# EAGLE design plutosdr-revb-extclk (EAGLE 7.7.0)
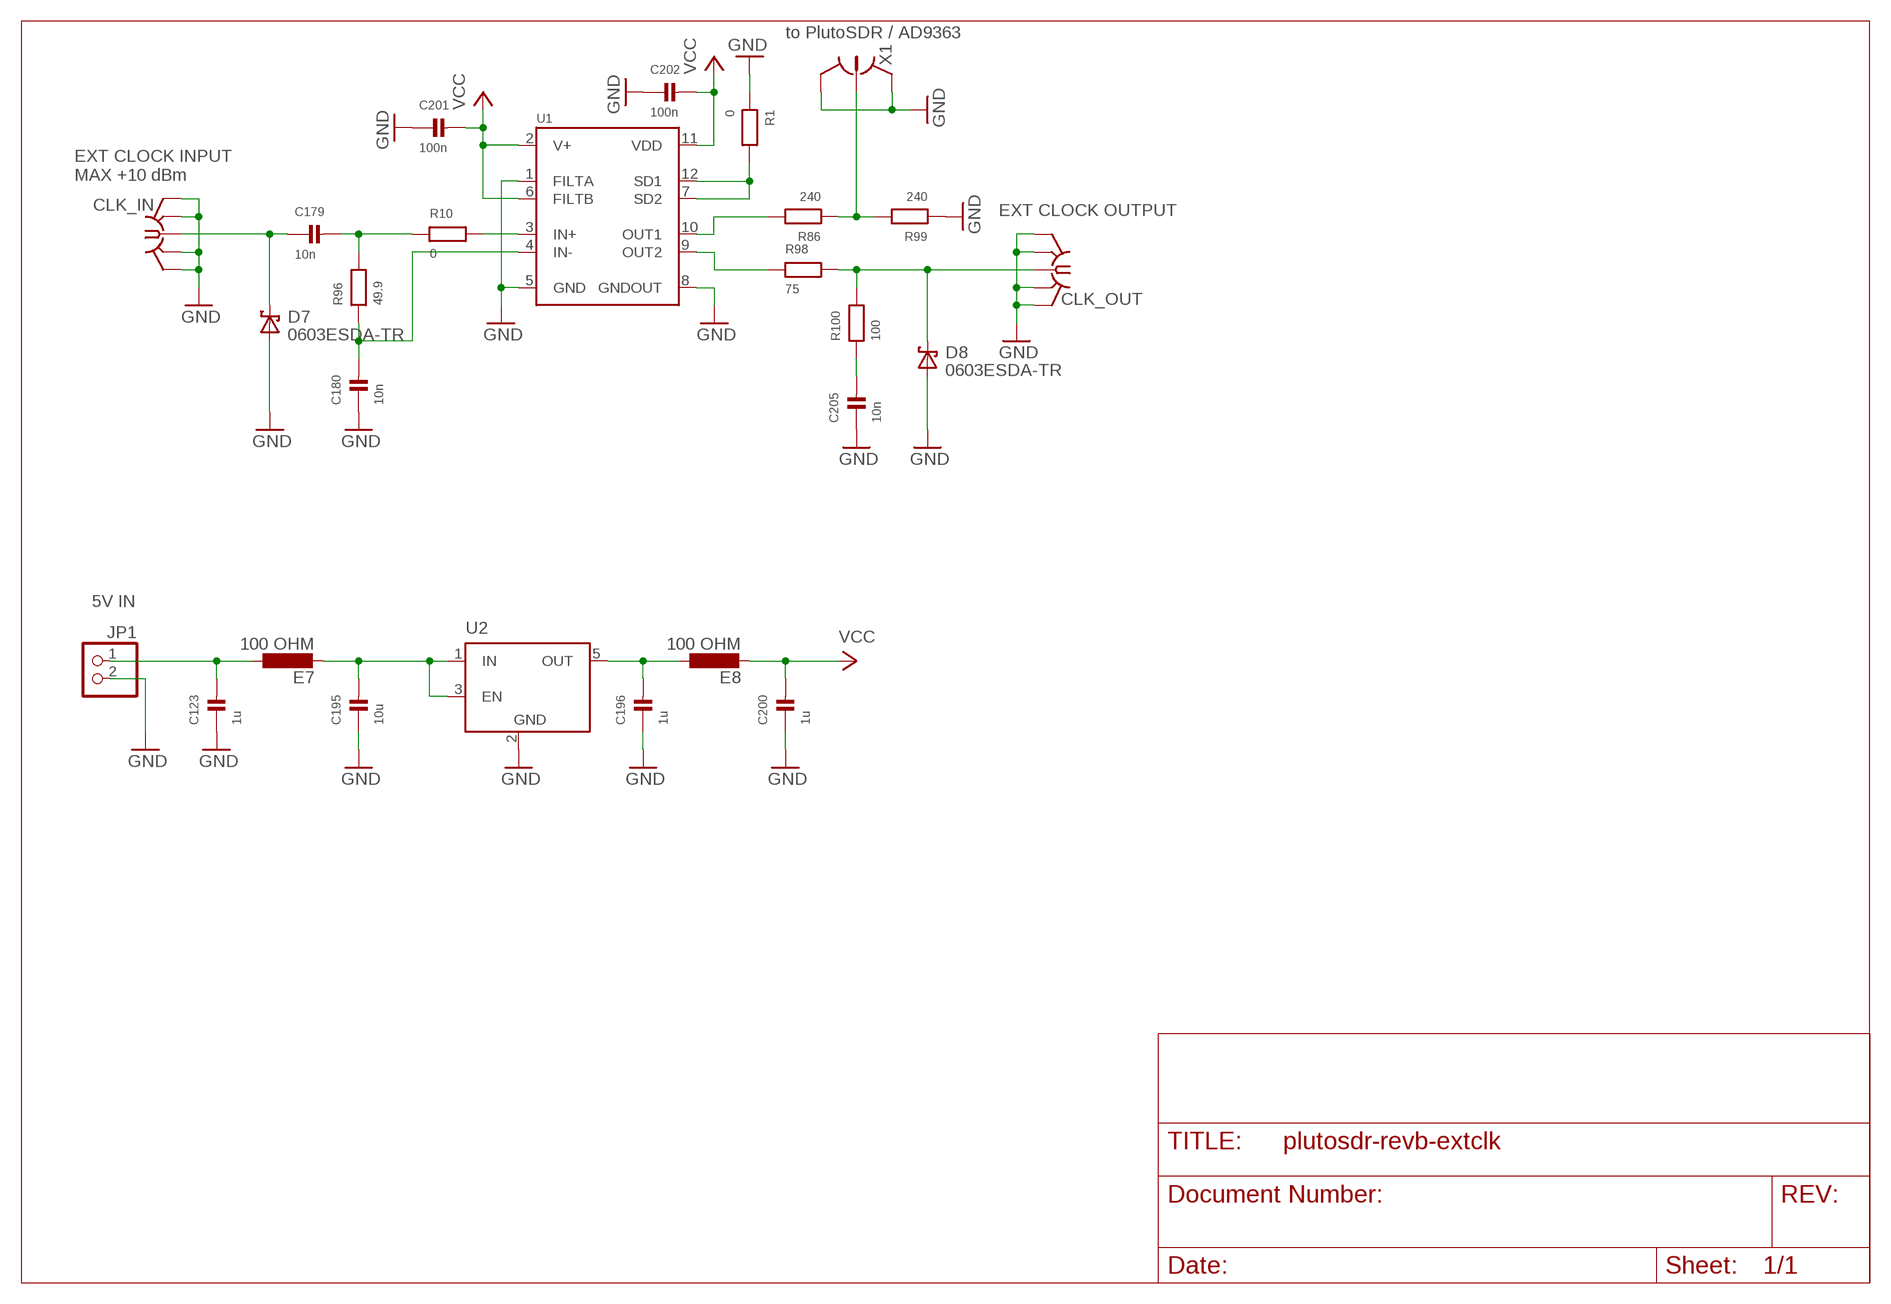
[diagram p0: schematic, sheet 1]

## Parts
C123  1u  CAP_CERAMIC_0603  [_0603]
C179  10n  CAP_CERAMIC_0603  [_0603]
C180  10n  CAP_CERAMIC_0603  [_0603]
C195  10u  CAP_CERAMIC_0805  [_0805]
C196  1u  CAP_CERAMIC_0603  [_0603]
C200  1u  CAP_CERAMIC_0603  [_0603]
C201  100n  CAP_CERAMIC_0603  [_0603]
C202  100n  CAP_CERAMIC_0603  [_0603]
C205  10n  CAP_CERAMIC_0603  [_0603]
CLK_IN  SMA-F73251-2201  [SMA-F-S-TH-73251-2201]
CLK_OUT  SMA-F73251-2201  [SMA-F-S-TH-73251-2201]
D7  0603ESDA-TR  [0603]
D8  0603ESDA-TR  [0603]
E7  100 OHM  INDUCTOR0805  [0805]
E8  100 OHM  INDUCTOR0805  [0805]
JP1  PINHD-1X2/90  [1X02/90]
R1  0  RESISTOR_0603  [_0603]
R10  0  RESISTOR_0603  [_0603]
R86  240  RESISTOR_0603  [_0603]
R96  49.9  RESISTOR_0603  [_0603]
R98  75  RESISTOR_0603  [_0603]
R99  240  RESISTOR_0603  [_0603]
R100  100  RESISTOR_0603  [_0603]
U1  LTC6957-3/4-HMS  [MSOP12]
U2  LDO_FIXED_EN-ADM7160AUJZ  [SOT23L]
X1  HRS_UFL  [HRS_UFL]

## Nets
3V3_OUT: C196.2 E8.1 U2.5(OUT)
5V_FILTERED: C195.2 E7.2 U2.1(IN) U2.3(EN)
5V_IN: C123.2 E7.1 JP1.1
GND: C123.1 C180.1 C195.1 C196.1 C200.1 C201.1 C202.1 C205.1 CLK_IN.G1(GND) CLK_IN.G2(GND) CLK_IN.G3(GND) CLK_IN.G4(GND) CLK_OUT.G1(GND) CLK_OUT.G2(GND) CLK_OUT.G3(GND) CLK_OUT.G4(GND) D7.1(A) D8.1(A) JP1.2 R1.1 R99.1 U1.1(FILTA) U1.5(GND) U1.8(GNDOUT) U2.2(GND) X1.GND@1(GND) X1.GND@2(GND)
N$1: R86.1 R99.2 X1.SIG
N$2: R86.2 U1.10(OUT1)
N$3 [RF]: R10.2 U1.3(IN+)
N$4: C180.2 R96.1 U1.4(IN-)
N$5 [RF]: C179.2 R10.1 R96.2
N$6 [RF]: R98.1 U1.9(OUT2)
N$7: R1.2 U1.7(SD2) U1.12(SD1)
N$8 [RF]: CLK_OUT.C D8.2(K) R98.2 R100.2
N$9: C205.2 R100.1
N$10 [RF]: C179.1 CLK_IN.C D7.2(K)
VCC: C200.2 C201.2 C202.2 E8.2 U1.2(V+) U1.6(FILTB) U1.11(VDD)

## Notes on the sheet
- to PlutoSDR / AD9363
- EXT CLOCK INPUT
  MAX +10 dBm
- EXT CLOCK OUTPUT
- 5V IN

## Library data of the parts
C123 C179 C180 C195 C196 C200-C202 C205 = rc-sysmocom:CAP_CERAMIC: Ceramic Capacitors 0402 - 0402 Surface Mount Capacitors 16pF 50V 5% [Digikey: 445-4899-2-ND] 18pF 50V 5% [Digikey: 490-1281-2-ND] 22pF 50V 5% [Digikey: 490-1283-2-ND] 68pF 50V 5% [Digikey: 490-1289-2-ND] 0.1uF 10V 10% [Digikey: 490-1318-2-ND] 1.0uF 6.3V 10% [Digikey: 490-1320-2-ND] 0603 - 0603 Surface Mount Capacitors 16 pF 50V 5% [Digikey: 445-5051-2-ND] 22 pF 50V [Digikey: PCC220ACVTR-ND] 33 pF 50V 5% [Digikey: 490-1415-1-ND] 56pF 50V 5% [Digikey: 490-1421-1-ND] 220pF 50V 5% [Digikey: 445-1285-1-ND] 680 pF 50V 2200 pF 50V 5% C0G [Digikey: 445-1297-1-ND] 5600 pF 100V 5% X7R [Digikey: 478-3711-1-ND] 0.1 µF 25V 10% [Digikey: PCC2277TR-ND] 0.22 µF 16V 10% X7R [Digikey: 445-1318-1-ND] 1.0 µF 25V 10% [Digikey: 445-5146-2-ND] 0603 - RF Specific 3pF 250V +/-0.1pF RF [Digikey: 712-1347-1-ND] 18 pF 250V 5% [Digikey: 478-3505-1-ND or 712-1322-1-ND] 56 pF 250V 5% C0G RF [Digikey: 490-4867-1-ND] 68 pF 250V RF [Digikey: 490-4868-1-ND] 0805 - 0805 Surface Mount Capacitors 220 pF 250V 2% RF Ceramic Capacitor [Digikey: 712-1398-1-ND] 1000 pF 50V 2% NP0 Ceramic Capacitor [Digikey: 478-3760-1-ND] 0.1 µF 25V 10% Ceramic Capacitor [Digikey: PCC1828TR-ND] 1.0 µF 16V 10% Ceramic Capacitor[Digikey: 490-1691-2-ND] 10.0 µF 10V 10% Ceramic Capacitor[Digikey: 709-1228-1-ND] 10.0 uF 16V 10% Ceramic Capacitor [Digikey: 478-5165-2-ND] 47 uF 6.3V 20% Ceramic Capacitor [Digikey: 587-1779-1-ND or 399-5506-1-ND] 1206 - 1206 Surface Mount Capacitors 47uF 10V 20% Ceramic Capacitor [Digikey: 490-5528-1-ND or 399-5508-1-ND or 445-6010-1-ND] 100uF 6.3V -20%, +80% Y5V Ceramic Capacitor (Digikey: 490-4512-1-ND, Mouser: 81-GRM31CF50J107ZE1L) 1810 - 1810 Surface Mount Capacitors High volt MLC; no solder stop between for higher isolation
CLK_IN CLK_OUT = laforge:SMA-F
D7 D8 = laforge:0603ESDA-TR: Bussmann 0603ESDA-TR ESD Suppressor
E7 E8 = rc-sysmocom:INDUCTOR
JP1 = laforge:PINHD-1X2: PIN HEADER
R1 R10 R86 R96 R98-R100 = rc-sysmocom:RESISTOR: Resistors 0402 - 0402 Surface Mount Package 22 Ohm 1% 1/16W [Digikey: 311-22.0LRTR-ND] 33 Ohm 5% 1/16W 1.0K 5% 1/16W 1.5K 5% 1/16W 2.0K 1% 1/16W 10.0K 1% 1/16W [Digikey: 311-10.0KLRTR-ND] 10.0K 5% 1/16W [Digikey: RMCF0402JT10K0TR-ND] 12.1K 1% 1/16W [Digikey: 311-22.0LRTR-ND] 100.0K 5% 1/16W 0603 - 0603 Surface Mount Package 1/10 Watt 0805 - 0805 Surface Mount Package 1/8 Watt 1206 - 1206 Surface Mount Package 2012 - 2010 Surface Mount Package 0.11 Ohm 1/2 Watt 1% Resistor - Digikey: RHM.11UCT-ND
U1 = cdclvc-clockbuf:LTC6957-3/4: LTC6957-1/LTC6957-2/LTC6957-3/LTC6957-4 Low Phase Noise, Dual Output Buffer/Driver/Logic Converter
U2 = ldo:LDO_FIXED_EN: ADM7160 Untralow Noise 200mA linear regulator
X1 = laforge:HRS_UFL: Hirose U.FL SMT; OC_DIGIKEY: H9161CT-ND

## Net classes
1 RF: width 1.5 mm, clearance 0.254 mm

## Board
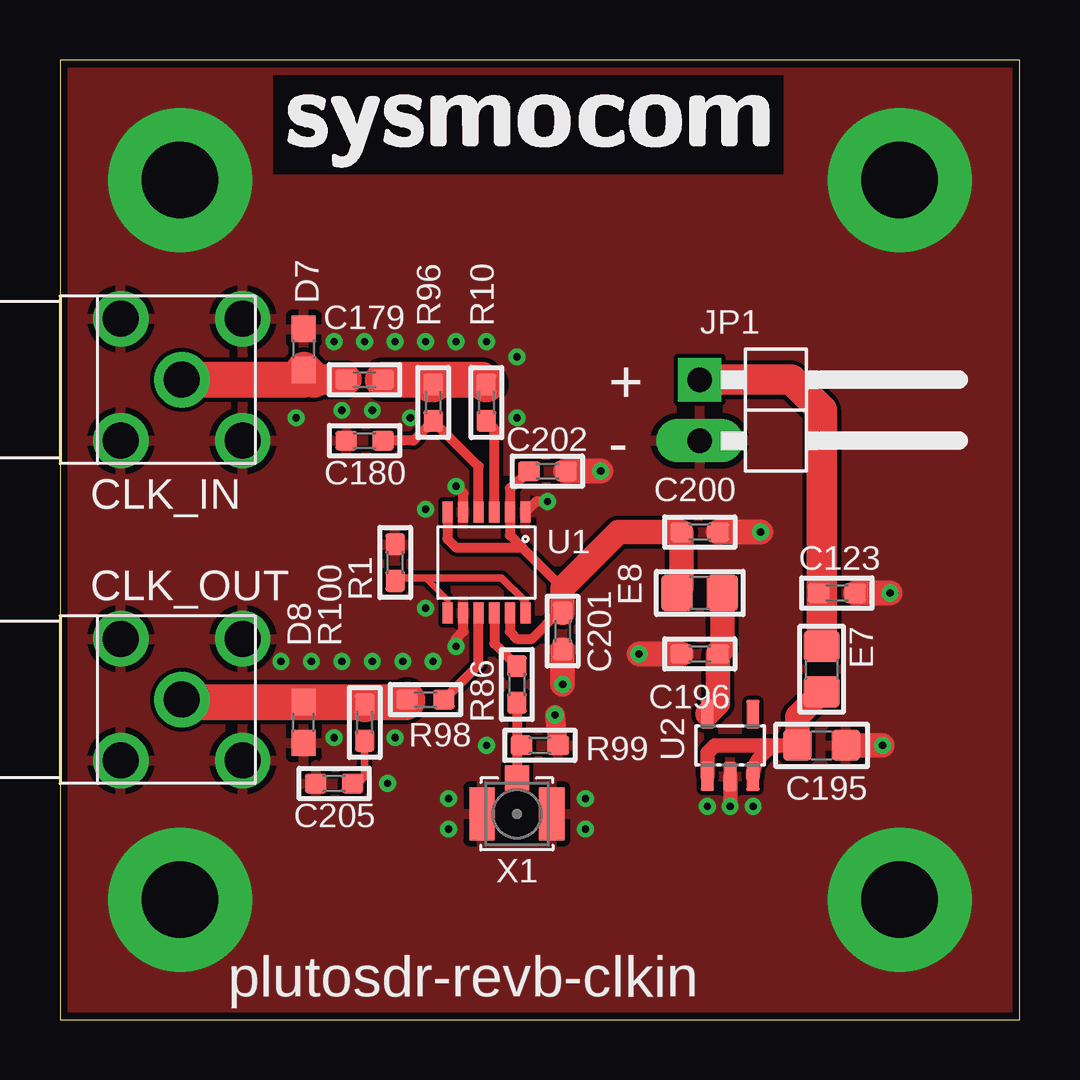
[diagram p1: board, top side]
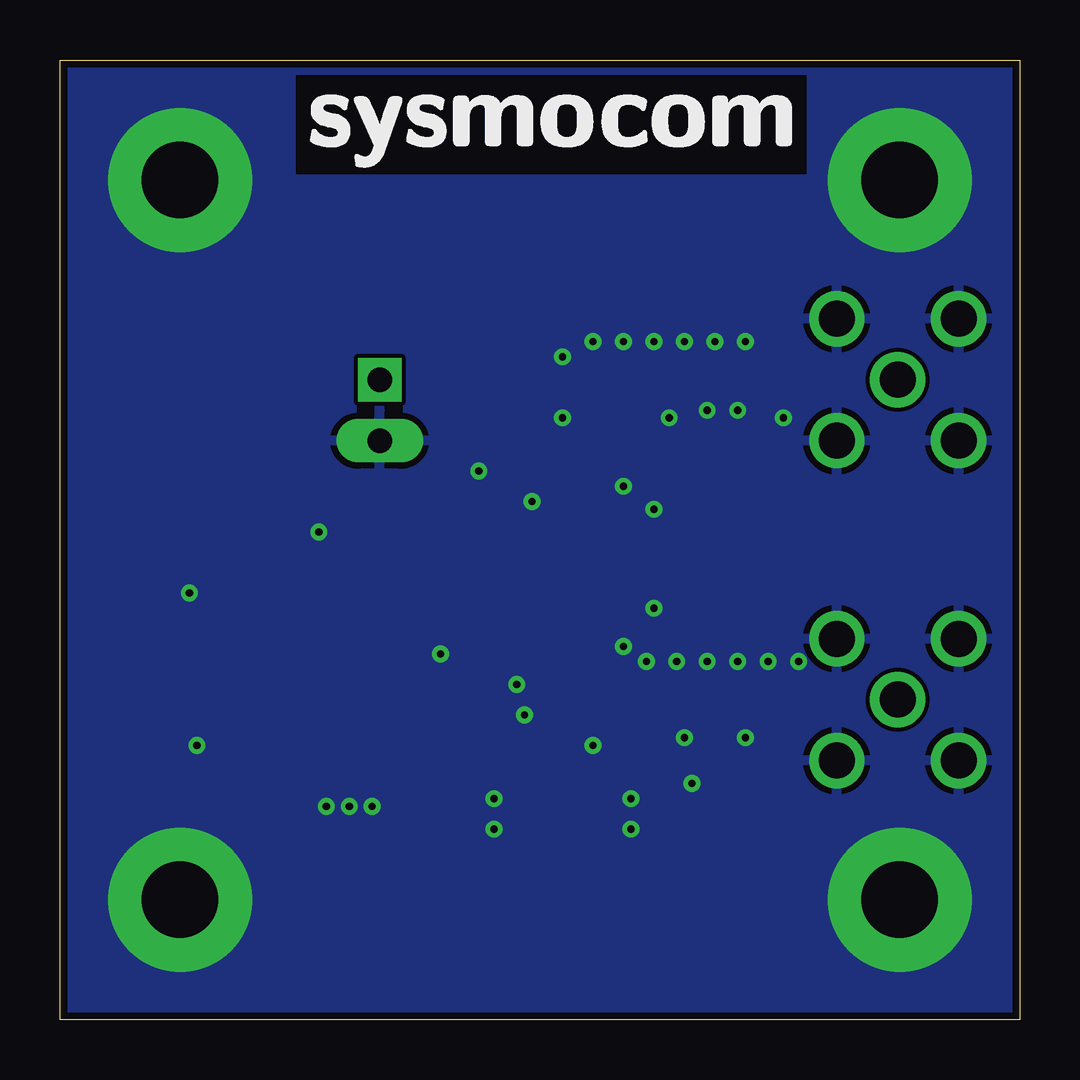
[diagram p2: board, bottom side, seen from below]

Size 40 x 40 mm. Coordinates in mm from the lower left corner, seen from the top.
Outline: 0,0 40,0 40,40 0,40 0,0
Copper layers (1*16): Top 0.035mm / dielectric 1.5mm / Bottom 0.035mm
Design rules "aisler_2_layer_simple *": minimum track width 0.2mm, minimum drill 0.3mm, track to track 0.175mm, track to pad 0.175mm, pad to pad 0.175mm, via to via 0.175mm, smd to smd 0.175mm, copper to edge 0.3mm, drill to drill 0.25mm, minimum pad ring 0.4mm, minimum via ring 0.2mm, stop-mask expansion 0mil, vias tented up to drill 0.35mm, thermal gap 10mil
tRestrict: area 8.9,35.2 to 30.2,39.4
bRestrict: area 8.9,35.2 to 30.2,39.4

### Footprints (pad centres in the part's own frame; a part is rotated, then mirrored left to right if it is on the bottom)
_0603 = smd 0.9 x 0.8: 1 -0.762,0; 2 0.762,0
_0805 = smd 1.2 x 1.3: 1 -1.016,0; 2 1.016,0
SMA-F-S-TH-73251-2201 = drill 1.5: C 0,0; G1 -2.54,2.54; G2 2.54,2.54; G3 -2.54,-2.54; G4 2.54,-2.54
0603 = smd 1.1 x 1: 1 -0.85,0; 2 0.85,0
0805 = smd 1.3 x 1.5: 1 -0.95,0; 2 0.95,0
1X02/90 = drill 1.016 square: 1 -1.27,-3.81 | drill 1.016 long: 2 1.27,-3.81
MSOP12 = smd 0.42 x 0.889: 1 -1.625,-2.105; 2 -0.975,-2.105; 3 -0.325,-2.105; 4 0.325,-2.105; 5 0.975,-2.105; 6 1.625,-2.105; 7 1.625,2.105; 8 0.975,2.105; 9 0.325,2.105; 10 -0.325,2.105; 11 -0.975,2.105; 12 -1.625,2.105
SOT23L = smd 0.55 x 1.2: 1 -0.95,-1.3; 2 0,-1.3; 3 0.95,-1.3; 4 0.95,1.3; 5 -0.95,1.3
HRS_UFL = smd 1.05 x 2.2: GND@1 -1.452,0; GND@2 1.452,0 | smd 1 x 1.05: SIG 0,-1.502

### Placement (x,y rotation side)
C123  32.38,17.78 180 top
C179  12.7,26.67 0 top
C180  12.7,24.13 0 top
C195  31.75,11.43 180 top
C196  26.67,15.24 0 top
C200  26.67,20.32 180 top
C201  20.95,16.19 90 top
C202  20.32,22.86 180 top
C205  11.43,9.84 0 top
CLK_IN  5.08,26.67 0 top
CLK_OUT  5.08,13.34 0 top
D7  10.16,27.94 270 top
D8  10.16,12.38 90 top
E7  31.75,14.61 270 top
E8  26.67,17.78 180 top
JP1  30.48,25.4 270 top
R1  13.97,19.05 270 top
R10  17.78,25.72 270 top
R86  19.05,13.97 90 top
R96  15.56,25.72 90 top
R98  15.24,13.34 180 top
R99  20,11.43 180 top
R100  12.7,12.38 90 top
U1  17.78,19.05 180 top
U2  27.94,11.43 0 top
U$1  [SYSMOCOM-20-TOP]  9.53,35.56 0 top
U$2  [SYSMOCOM-20]  9.53,35.56 0 top
U$3  [SYSMOCOM-20-BOT]  9.53,35.56 0 top
U$4  [SYSMOCOM-20-BPLACE]  9.53,35.56 0 top
X1  19.05,8.57 180 top

### Tracks (layer width: path | path; a pad name or v marks a point on that pad's centre or on a via)
3V3_OUT
  Top 1.016: U2.5 27.43,13.17 C196.2 27.62,15.43 E8.1
5V_FILTERED
  Top 0.61: U2.1 26.99,11.12 27.3,11.43 C195.2 30.19,11.43 arc90 U2.3
  Top 1.016: E7.2 30.73,12.64 C195.2
5V_IN
  Top 0.2: C123.2 31.62,15.68 E7.1
  Top 1.27: JP1.1 30.48,26.67 31.75,25.4 E7.1
GND  (via drill 0.3, 3.2 pad 6)
  Top 0.406: v16.51,22.23 16.8,21.93 U1.5 | U1.8 16.8,16.17 16.51,15.88 v16.51,15.56 | v20.32,21.59 19.84,21.59 U1.1
  Top 0.61: v27.94,8.89 U2.2
  Top 0.813: R99.1 v20.64,12.7
  Top 1.016: C201.1 v20.95,13.97 | C200.1 v29.21,20.32 | C195.1 v34.29,11.43 | C196.1 v24.13,15.24 | C123.1 v34.61,17.78 | C202.1 v22.54,22.86
  other vias: 21.91,9.21 21.91,7.94 16.19,7.94 16.19,9.21 9.84,25.08 11.75,25.4 14.61,25.08 13.02,25.4 15.24,28.26 16.51,28.26 17.78,28.26 19.05,27.62 13.97,28.26 12.7,28.26 11.43,28.26 9.21,14.92 10.48,14.92 11.75,14.92 13.02,14.92 14.29,14.92 15.56,14.92 17.78,11.43 13.97,11.75 13.65,9.84 11.43,11.75 5,35 35,35 35,5 5,5 26.99,8.89 28.89,8.89 19.05,25.08 15.24,21.27 15.24,17.14
  pour Bottom: 0,0 0,40 40,40 40,0
  pour Top: 0,0 0,40 40,40 40,0
N$1
  Top 0.2: X1.SIG 19.05,11.24 R99.2
  Top 0.406: R86.1 X1.SIG
N$2
  Top 0.406: U1.10 18.11,15.68 R86.2
N$3
  Top 0.406: U1.3 18.11,24.63 R10.2
N$4
  Top 0.406: U1.4 17.45,23.06 R96.1 14.73,24.13 C180.2
N$5
  Top 1.5: C179.2 15.24,26.67 | 15.24,26.67 17.59,26.67 R10.1 | R96.2 15.43,26.48 15.24,26.67
N$6
  Top 0.406: R98.1 17.45,14.79 U1.9
N$7
  Top 0.254: 14.1,18.41 15.24,18.41 16.16,17.5 U1.7
  Top 0.305: R1.2 14.1,18.41 18.41,18.41 19.41,17.43 U1.12
N$8
  Top 1.5: CLK_OUT.C 5.18,13.23 D8.2 12.7,13.23 | 12.7,13.23 14.38,13.23 arc90 R98.2 | R100.2 12.7,13.23
N$9
  Top 0.305: R100.1 12.7,10.26 arc-90 C205.2
N$10
  Top 1.27: 10.58,26.67 C179.1
  Top 1.5: 10.58,26.67 D7.2 10.16,26.67 CLK_IN.C
VCC
  Top 0.305: 16.38,19.81 16.51,19.68
  Top 0.406: C202.2 18.75,22.14 U1.2 18.75,20.2 19.27,19.68 | U1.6 16.16,20.04 16.51,19.68 19.27,19.68 | 20.95,18 19.27,19.68 | U1.11 18.75,16.17 19.05,15.88 19.68,15.88 20.85,17.04 C201.2
  Top 1.016: C201.2 20.95,18 23.28,20.32 C200.2 25.91,17.97 E8.2

### Text on the board
tNames: + | - | plutosdr-revb-clkin